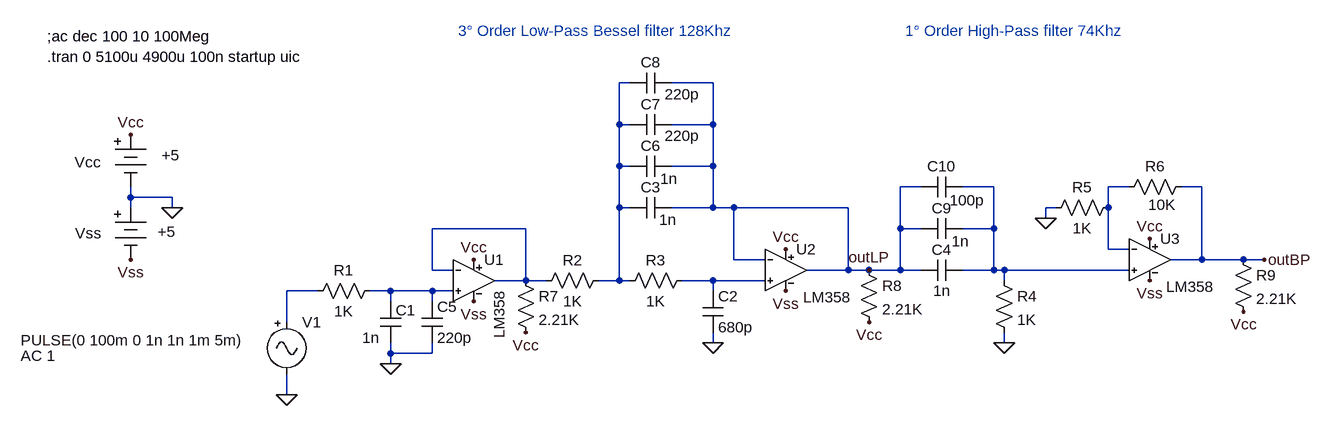
[diagram p0: schematic LM358_BreadBoard_Implementation.asc]
LM358_BreadBoard_Implementation.asc, the LTspice schematic file:
Version 4
SHEET 1 1708 680
WIRE 496 -304 480 -304
WIRE 624 -304 560 -304
WIRE 480 -240 480 -304
WIRE 496 -240 480 -240
WIRE 624 -240 624 -304
WIRE 624 -240 560 -240
WIRE 480 -176 480 -240
WIRE 496 -176 480 -176
WIRE 624 -176 624 -240
WIRE 624 -176 560 -176
WIRE 944 -144 912 -144
WIRE 1056 -144 1008 -144
WIRE 1264 -144 1232 -144
WIRE 1376 -144 1344 -144
WIRE -272 -128 -272 -144
WIRE -208 -128 -272 -128
WIRE -272 -112 -272 -128
WIRE -208 -112 -208 -128
WIRE 480 -112 480 -176
WIRE 496 -112 480 -112
WIRE 624 -112 624 -176
WIRE 624 -112 560 -112
WIRE 656 -112 624 -112
WIRE 832 -112 656 -112
WIRE 1152 -112 1136 -112
WIRE 1232 -112 1232 -144
WIRE 1136 -96 1136 -112
WIRE 336 -80 192 -80
WIRE 912 -80 912 -144
WIRE 944 -80 912 -80
WIRE 1056 -80 1056 -144
WIRE 1056 -80 1008 -80
WIRE 1232 -48 1232 -112
WIRE 1264 -48 1232 -48
WIRE 656 -32 656 -112
WIRE 704 -32 656 -32
WIRE 1376 -32 1376 -144
WIRE 1376 -32 1328 -32
WIRE 1440 -32 1376 -32
WIRE 1472 -32 1440 -32
WIRE 192 -16 192 -80
WIRE 224 -16 192 -16
WIRE 832 -16 832 -112
WIRE 832 -16 768 -16
WIRE 864 -16 832 -16
WIRE 912 -16 912 -80
WIRE 912 -16 864 -16
WIRE 944 -16 912 -16
WIRE 1056 -16 1056 -80
WIRE 1056 -16 1008 -16
WIRE 1072 -16 1056 -16
WIRE 1264 -16 1072 -16
WIRE 336 0 336 -80
WIRE 336 0 288 0
WIRE 368 0 336 0
WIRE 480 0 480 -112
WIRE 480 0 448 0
WIRE 496 0 480 0
WIRE 624 0 576 0
WIRE 704 0 624 0
WIRE 1072 0 1072 -16
WIRE 16 16 -32 16
WIRE 128 16 96 16
WIRE 192 16 128 16
WIRE 224 16 192 16
WIRE 624 16 624 0
WIRE 128 32 128 16
WIRE 192 32 192 16
WIRE -32 64 -32 16
WIRE 624 96 624 80
WIRE 1072 96 1072 80
WIRE 128 112 128 96
WIRE 192 112 192 96
WIRE 192 112 128 112
WIRE 128 128 128 112
WIRE -32 176 -32 144
FLAG -32 176 0
FLAG 624 96 0
FLAG 864 -16 outLP
FLAG 1072 96 0
FLAG 1472 -32 outBP
FLAG -208 -112 0
FLAG -272 -224 Vcc
FLAG -272 -32 Vss
FLAG 256 -32 Vcc
FLAG 736 -48 Vcc
FLAG 1296 -64 Vcc
FLAG 256 32 Vss
FLAG 736 16 Vss
FLAG 1296 0 Vss
FLAG 128 128 0
FLAG 1136 -96 0
FLAG 336 80 Vcc
FLAG 864 64 Vcc
FLAG 1440 48 Vcc
SYMBOL Misc\\signal -32 48 R0
WINDOW 3 -409 44 Left 2
WINDOW 123 -409 68 Left 2
WINDOW 39 0 0 Left 0
SYMATTR Value PULSE(0 100m 0 1n 1n 1m 5m)
SYMATTR Value2 AC 1
SYMATTR InstName V1
SYMBOL res 112 0 R90
WINDOW 0 0 56 VBottom 2
WINDOW 3 32 56 VTop 2
SYMATTR InstName R1
SYMATTR Value 1K
SYMATTR SpiceLine tol=1 pwr=0.1
SYMBOL cap 112 32 R0
WINDOW 0 24 14 Left 2
WINDOW 3 -28 56 Left 2
SYMATTR InstName C1
SYMATTR Value 1n
SYMATTR SpiceLine V=25 Irms=0 Rser=0.23112 Lser=501.24p mfg="Würth Elektronik" pn="885012208046 WCAP-CSGP 1206" type="X7R"
SYMBOL res 464 -16 R90
WINDOW 0 0 56 VBottom 2
WINDOW 3 32 56 VTop 2
SYMATTR InstName R2
SYMATTR Value 1K
SYMATTR SpiceLine tol=1 pwr=0.1
SYMBOL res 592 -16 R90
WINDOW 0 0 56 VBottom 2
WINDOW 3 32 56 VTop 2
SYMATTR InstName R3
SYMATTR Value 1K
SYMATTR SpiceLine tol=1 pwr=0.1
SYMBOL cap 608 16 R0
SYMATTR InstName C2
SYMATTR Value 680p
SYMATTR SpiceLine V=25 Irms=0 Rser=0.32598 Lser=652.7p mfg="Würth Elektronik" pn="885012208045 WCAP-CSGP 1206" type="X7R"
SYMBOL cap 560 -128 R90
WINDOW 0 0 32 VBottom 2
WINDOW 3 19 5 VTop 2
SYMATTR InstName C3
SYMATTR Value 1n
SYMATTR SpiceLine V=25 Irms=0 Rser=0.23112 Lser=501.24p mfg="Würth Elektronik" pn="885012208046 WCAP-CSGP 1206" type="X7R"
SYMBOL cap 1008 -32 R90
WINDOW 0 0 32 VBottom 2
WINDOW 3 32 32 VTop 2
SYMATTR InstName C4
SYMATTR Value 1n
SYMATTR SpiceLine V=25 Irms=0 Rser=0.23112 Lser=501.24p mfg="Würth Elektronik" pn="885012208046 WCAP-CSGP 1206" type="X7R"
SYMBOL res 1056 -16 R0
SYMATTR InstName R4
SYMATTR Value 1K
SYMATTR SpiceLine tol=1 pwr=0.1
SYMBOL Misc\\battery -272 -240 R0
WINDOW 0 -86 58 Left 2
WINDOW 3 48 47 Left 2
WINDOW 123 0 0 Left 0
WINDOW 39 0 0 Left 0
SYMATTR InstName Vcc
SYMATTR Value +5
SYMBOL Misc\\battery -272 -128 R0
WINDOW 0 -85 55 Left 2
WINDOW 3 42 53 Left 2
WINDOW 123 0 0 Left 0
WINDOW 39 0 0 Left 0
SYMATTR InstName Vss
SYMATTR Value +5
SYMBOL AutoGenerated\\LM358 256 0 R0
WINDOW 3 55 52 VBottom 2
SYMATTR InstName U1
SYMBOL AutoGenerated\\LM358 736 -16 R0
WINDOW 3 64 26 Top 2
SYMATTR InstName U2
SYMBOL AutoGenerated\\LM358 1296 -32 R0
WINDOW 3 62 26 Top 2
SYMATTR InstName U3
SYMBOL cap 176 32 R0
SYMATTR InstName C5
SYMATTR Value 220p
SYMATTR SpiceLine V=6.3 Irms=5.76m Rser=19.9214 Lser=0 mfg="KEMET" pn="C0805C221K9RAC" type="X7R"
SYMBOL cap 560 -192 R90
WINDOW 0 0 32 VBottom 2
WINDOW 3 20 4 VTop 2
SYMATTR InstName C6
SYMATTR Value 1n
SYMATTR SpiceLine V=25 Irms=0 Rser=0.23112 Lser=501.24p mfg="Würth Elektronik" pn="885012208046 WCAP-CSGP 1206" type="X7R"
SYMBOL cap 560 -256 R90
WINDOW 0 0 32 VBottom 2
WINDOW 3 18 -17 VTop 2
SYMATTR InstName C7
SYMATTR Value 220p
SYMATTR SpiceLine V=25 Irms=0 Rser=0.115723 Lser=436.176p mfg="Würth Elektronik" pn="885012007036 WCAP-CSGP 0805" type="NP0"
SYMBOL cap 560 -320 R90
WINDOW 0 0 32 VBottom 2
WINDOW 3 18 -17 VTop 2
SYMATTR InstName C8
SYMATTR Value 220p
SYMATTR SpiceLine V=25 Irms=0 Rser=0.115723 Lser=436.176p mfg="Würth Elektronik" pn="885012007036 WCAP-CSGP 0805" type="NP0"
SYMBOL cap 1008 -96 R90
WINDOW 0 0 32 VBottom 2
WINDOW 3 20 3 VTop 2
SYMATTR InstName C9
SYMATTR Value 1n
SYMATTR SpiceLine V=25 Irms=0 Rser=0.23112 Lser=501.24p mfg="Würth Elektronik" pn="885012208046 WCAP-CSGP 1206" type="X7R"
SYMBOL cap 1008 -160 R90
WINDOW 0 0 32 VBottom 2
WINDOW 3 21 -7 VTop 2
SYMATTR InstName C10
SYMATTR Value 100p
SYMATTR SpiceLine V=10 Irms=0 Rser=0.88264 Lser=318.58p mfg="Würth Elektronik" pn="885012207004 WCAP-CSGP 0805" type="X7R"
SYMBOL res 1248 -128 R90
WINDOW 0 0 56 VBottom 2
WINDOW 3 32 56 VTop 2
SYMATTR InstName R5
SYMATTR Value 1K
SYMATTR SpiceLine tol=1 pwr=0.1
SYMBOL res 1360 -160 R90
WINDOW 0 0 56 VBottom 2
WINDOW 3 28 45 VTop 2
SYMATTR InstName R6
SYMATTR Value 10K
SYMATTR SpiceLine tol=1 pwr=0.1
SYMBOL res 320 -16 R0
SYMATTR InstName R7
SYMATTR Value 2.21K
SYMATTR SpiceLine tol=1 pwr=0.1
SYMBOL res 848 -32 R0
SYMATTR InstName R8
SYMATTR Value 2.21K
SYMATTR SpiceLine tol=1 pwr=0.1
SYMBOL res 1424 -48 R0
SYMATTR InstName R9
SYMATTR Value 2.21K
SYMATTR SpiceLine tol=1 pwr=0.1
TEXT -400 -376 Left 2 !;ac dec 100 10 100Meg
TEXT -400 -344 Left 2 !.tran 0 5100u 4900u 100n startup uic
TEXT 232 -384 Left 2 ;3° Order Low-Pass Bessel filter 128Khz
TEXT 920 -384 Left 2 ;1° Order High-Pass filter 74Khz

The netlist it stands for:
* LM358_BreadBoard_Implementation.asc
V1 N006 0 PULSE(0 100m 0 1n 1n 1m 5m) AC 1
R1 N007 N006 1K tol=1 pwr=0.1
C1 N007 0 1n V=25 Irms=0 Rser=0.23112 Lser=501.24p mfg="Würth Elektronik" pn="885012208046 WCAP-CSGP 1206" type="X7R"
R2 N001 N004 1K tol=1 pwr=0.1
R3 N005 N001 1K tol=1 pwr=0.1
C2 N005 0 680p V=25 Irms=0 Rser=0.32598 Lser=652.7p mfg="Würth Elektronik" pn="885012208045 WCAP-CSGP 1206" type="X7R"
C3 outLP N001 1n V=25 Irms=0 Rser=0.23112 Lser=501.24p mfg="Würth Elektronik" pn="885012208046 WCAP-CSGP 1206" type="X7R"
C4 N002 outLP 1n V=25 Irms=0 Rser=0.23112 Lser=501.24p mfg="Würth Elektronik" pn="885012208046 WCAP-CSGP 1206" type="X7R"
R4 N002 0 1K tol=1 pwr=0.1
Vcc Vcc 0 +5
Vss 0 Vss +5
XU1 N007 N004 Vcc Vss N004 LM358  ; pins In+ In- V+ V- OUT
XU2 N005 outLP Vcc Vss outLP LM358  ; pins In+ In- V+ V- OUT
XU3 N002 N003 Vcc Vss outBP LM358  ; pins In+ In- V+ V- OUT
C5 N007 0 220p V=6.3 Irms=5.76m Rser=19.9214 Lser=0 mfg="KEMET" pn="C0805C221K9RAC" type="X7R"
C6 outLP N001 1n V=25 Irms=0 Rser=0.23112 Lser=501.24p mfg="Würth Elektronik" pn="885012208046 WCAP-CSGP 1206" type="X7R"
C7 outLP N001 220p V=25 Irms=0 Rser=0.115723 Lser=436.176p mfg="Würth Elektronik" pn="885012007036 WCAP-CSGP 0805" type="NP0"
C8 outLP N001 220p V=25 Irms=0 Rser=0.115723 Lser=436.176p mfg="Würth Elektronik" pn="885012007036 WCAP-CSGP 0805" type="NP0"
C9 N002 outLP 1n V=25 Irms=0 Rser=0.23112 Lser=501.24p mfg="Würth Elektronik" pn="885012208046 WCAP-CSGP 1206" type="X7R"
C10 N002 outLP 100p V=10 Irms=0 Rser=0.88264 Lser=318.58p mfg="Würth Elektronik" pn="885012207004 WCAP-CSGP 0805" type="X7R"
R5 N003 0 1K tol=1 pwr=0.1
R6 outBP N003 10K tol=1 pwr=0.1
R7 N004 Vcc 2.21K tol=1 pwr=0.1
R8 outLP Vcc 2.21K tol=1 pwr=0.1
R9 outBP Vcc 2.21K tol=1 pwr=0.1
;ac dec 100 10 100Meg
.tran 0 5100u 4900u 100n startup uic
* 3° Order Low-Pass Bessel filter 128Khz
* 1° Order High-Pass filter 74Khz
.lib C:\Users\XXXX\XXXX
.backanno
.end

* Results of the author's LTspice run, read from the files saved beside the schematic
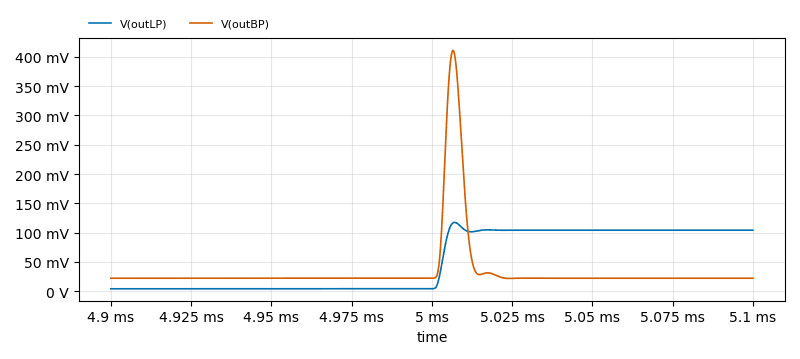
[diagram p1: Transient Analysis of LM358_BreadBoard_Implementation.asc, plotted from the saved traces]
* Transient Analysis, 1 run:
*   V(outLP): min 4.159 mV, max 117.5 mV, average 52.67 mV, rms 72.53 mV, last 104.2 mV
*   V(outBP): min 21.82 mV, max 411 mV, average 33.87 mV, rms 65.19 mV, last 22.21 mV